# Altium schematic sheet Power.SchDoc
size A4; SheetNumber: 2; SheetTotal: 4
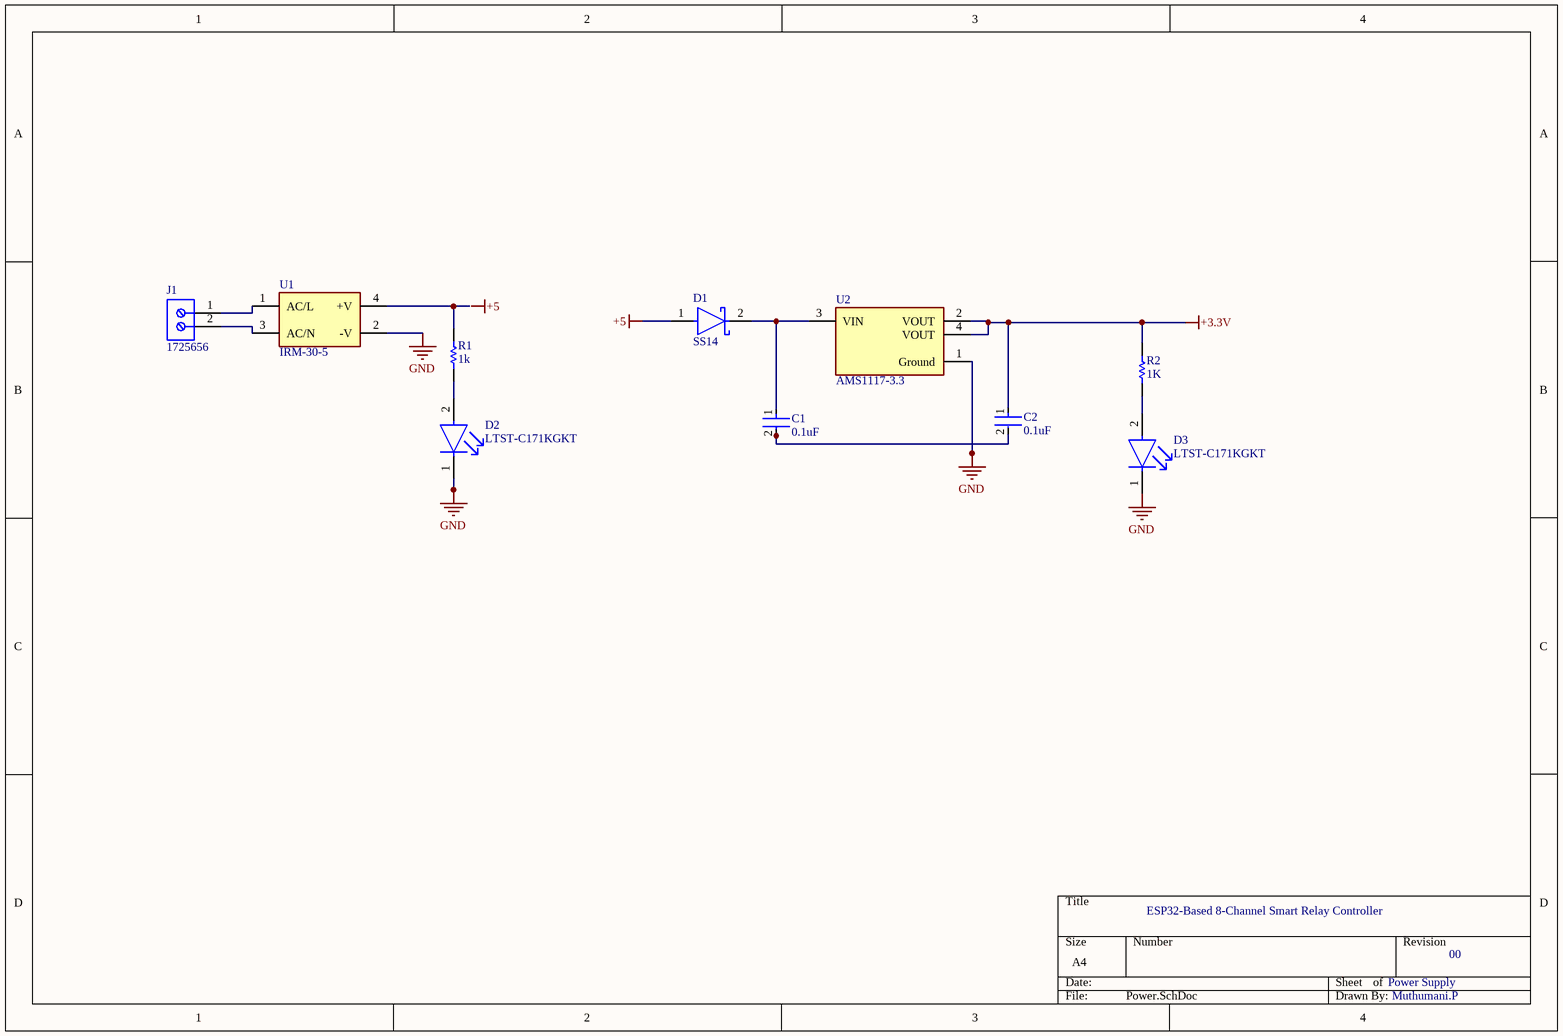
[diagram p0: Power.SchDoc]

## Parts
C1  0.1uF  [FP-1206-L_3_2_0_2-W_1_6_0-MFG]
C2  0.1uF  [FP-1206-L_3_2_0_2-W_1_6_0-MFG]
D1  SS14  [FP-403AE-MFG]
D2  LTST-C171KGKT  [FP-LTST-C171KGKT-MFG]
D3  LTST-C171KGKT  [FP-LTST-C171KGKT-MFG]
J1  1725656  [PHOE-1725656-2]
R1  1k  [RESC2013X60X35ML10T20]
R2  1K  [RESC2013X60X35ML10T20]
U1  IRM-30-5  [FP-IRM-30-5-MFG]
U2  AMS1117-3.3  [FP-AMS1117-IPC_C]

## Nets
+3.3V: C2.1 R2.2 U2.2(VOUT) U2.4(VOUT)
+5: D1.1(A)
GND: D2.1(C) D3.1(C) U1.2(-V) U2.1(Ground)
NetC1_1: C1.1 D1.2(C) U2.3(VIN)
NetC1_2: C1.2 C2.2
NetD2_2: D2.2(A) R1.1
NetD3_2: D3.2(A) R2.1
NetJ1_1: J1.1 U1.1(AC/L)
NetJ1_2: J1.2 U1.3(AC/N)
NetR1_2: R1.2 U1.4(+V)

## Notes on the sheet
- ESP32-Based 8-Channel Smart Relay Controller
- Power Supply
- 00
- Muthumani.P
- Labels drawn without touching a wire or pin: +5

## Library data of the parts
C1 C2 = CMP-04427-018471-1: General Purpose Ceramic Capacitor, 1206, 2.2uF, 20%, X7R, 15%, 100V; Package Quantity: 2500; Thickness: 0.037inch; Case/Package: 1206; Capacitance: 2.2uF; Length: 0.126inch; Packaging: Tape and Reel; Min Operating Temperature: -55°C; Voltage Rating: 100V; Mount: Surface Mount; Voltage Rating (DC): 100V; Tolerance: 20%; RoHS Compliant: Yes; Width: 0.063inch; Max Operating Temperature: 125°C
D1 = CMP-2000-04943-2: DIODE SCHOTTKY 40V 1A SMA; Manufacturer: ON Semiconductor; Peak Reverse Current: 0.2mA; Max Junction Temp: +125°C; Standoff Height: 0.05mm; Max Surge Forward Current: 40A; Mouser Description: Schottky Diodes & Rectifiers SMA 40V 1.0A; RoHS: TRUE; Lead Free: Yes; Manufacturer Part Number: SS14; Device Class L3: Schottky Diodes; Category: Diode; Automotive: No; Digikey Description: DIODE SCHOTTKY 40V 1A SMA; ComponentLink2Description: Datasheet; Device Class L2: Diodes; Height: 2.5mm; Temperature Range High: +125°C; ComponentLink2URL: https://www.onsemi.com/pub/Collateral/SS19-D.PDF; Device Class L1: Discrete Semiconductors; Package: 403AE; Octopart: https://octopart.com/ss14-on+semiconductor-29205033; Max Repetitive Reverse Voltage: 40V; Temperature Range Low: -65°C; Forward Current: 1A; Temperature: -65°C to +125°C
D2 D3 = CMP-22017-000037-1: LED GREEN CLEAR SMD; Number of LEDs: 1; Viewing Angle: 130°; Lens Style: Rectangular; Dominant Wavelength: 571nm; Test Current: 20mA; Luminous Intensity: 35mcd; Power Rating: 75mW; Forward Voltage: 2.4V; Forward Current: 30mA; Reverse Voltage: 5V; Lens Color: Colorless; Wavelength: 574nm; Height: 0.8mm; Illumination Color: Green; Length: 2mm; Case/Package: 0805; Number of Pins: 2; Number of Elements: 1; Package Quantity: 1; Depth: 1.25mm; Lens Transparency: Clear; Width: 1.25mm; Color: Green; Radiation Hardening: No; Mount: Surface Mount; Packaging: Tape and Reel; Case Code (Metric): 2012; Lead Free: Lead Free; Max Operating Temperature: 85°C; Min Operating Temperature: -55°C; Case Code (Imperial): 0805; Power Dissipation: 75mW
J1 = CMP-2000-05299-1: Male Header, Pitch 2.54 mm, 1 x 2 Position, Height 9 mm, Tail Length 3.5 mm; Manufacturer: Phoenix Contact; Number of contacts: 2; Content: 250pc(s); Pitch: 2.54mm; Industrial packaging: Yes; Colour: Green; Manufacturer part No.: 1725656; Type: MPT0,5/2-2,54; Datasheet URL: http://datasheet.octopart.com/1725656-Phoenix-Contact-datasheet-5302866.pdf; Manufacturer URL: http://www.phoenixcontact.com/; Datasheet Version: Apr-08
R1 R2 = CMP-2100-03671-1: Chip Resistor, 1 KOhm, +/- 1%, 125 mW, -55 to 155 degC, 0805 (2012 Metric), RoHS, Tape and Reel; Manufacturer: Yageo; Temperature Coefficient: 100ppm/degreesC; Voltage Rating (DC): 150V; Max Power Dissipation: 125mW; Resistance: 1KOhm; Number of Pins: 2; Number of Terminations: 2; Datasheet URL: http://www.yageo.com/NewPortal/yageodocoutput?fileName=/pdf/R-Chip/PYu-RC_Group_51_RoHS_L_5.pdf; Length: 0.079inch; Package Description: 2-Pin Surface Mounted Device, Body 2 x 1.25 mm; Depth: 1.25mm; Height: 0.024inch; Military Standard: Not; Case/Package: 0805; Package Reference: 0805; RoHSCompliant: true; Lead Free: LeadFree; Packaging: TapeandReel; Package Quantity: 1; Datasheet Version: Rev. 5, 10/2016; Tolerance: 1%; Min Operating Temperature: -55degC; Voltage Rating: 150V; Composition: ThickFilm; Case Code (Imperial): 0805; Power Rating: 125mW; Width: 0.049inch; Case Code (Metric): 2012; Manufacturer URL: http://www.yageo.com/; Max Operating Temperature: 155degC; REACH SVHC: Unknown; Termination: SMD/SMT
U1 = CMP-28435-000001-1: AC/DC CONVERTER 5V 30W; Manufacturer: Mean Well; Output Type: Fixed; Switching Topology: Buck; Max Supply Voltage: 264V; Number Of Outputs: 1; Switching Frequency: 65kHz; Nominal Supply Current: 0.5-0.75A; Min Supply Voltage: 85V; Output Current: 6A; Temperature: -30°C to +70°C; Device Class L1: Integrated Circuits (ICs); Temperature Range Low: -30°C; Temperature Range High: +70°C; ComponentLink2Description: Datasheet; Lead Free: Yes; Device Class L2: Power Management ICs; ComponentLink2URL: https://www.meanwell-web.com/content/files/pdfs/productPdfs/MW/IRM-30/IRM-30-spec.pdf; Mouser Description: 30W Encapsulated Board Mount Module AC/DC Power Supply with 5VDC Output; Automotive: No; Device Class L3: Voltage Regulators - Switching; Octopart: https://octopart.com/irm-30-5-mean+well-50976023; Category: IC; Package: IRM-30-5; Output Voltage: 5V; RoHS: TRUE; Manufacturer Part Number: IRM-30-5; Height: 24mm; Digikey Description: AC/DC CONVERTER 5V 30W
U2 = CMP-209535-000001-1: LDO Voltage Regulators 1A, 3.3V; Manufacturer: Advanced Monolithic Systems; Dropout Voltage: 1.1V; Output Type: Fixed; Nominal Supply Current: 5mA; Max Power Dissipation: 1.2W; Max Supply Voltage: 15V; Number Of Outputs: 1; Standoff Height: 0.64mm; Max Junction Temp: +125°C; Height: 1.8mm; Package: AMS1117; Device Class L2: Power Management ICs; ComponentLink2Description: Datasheet; ComponentLink2URL: http://www.advanced-monolithic.com/pdf/ds1117.pdf; Category: IC; RoHS: TRUE; Automotive: No; Device Class L1: Integrated Circuits (ICs); Output Current: 1A; Device Class L3: Voltage Regulators - Linear; Temperature: -40°C to +125°C; Output Voltage: 3.3V; Manufacturer Part Number: AMS1117-3.3; Temperature Range Low: -40°C; Octopart: https://octopart.com/ams1117-3.3-advanced+monolithic+systems-25899300; Lead Free: Yes; Ipc Land Pattern Name: SOT229P700X180-4; Temperature Range High: +125°C